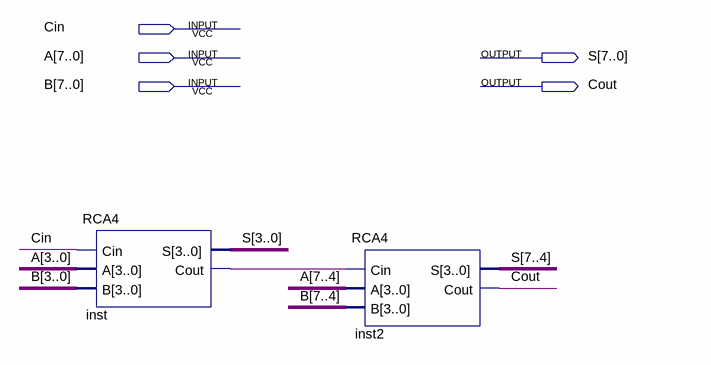
[diagram p0: schematic sheet]
// Quartus schematic RCA8.bdf as structural Verilog: 2 symbols, 5 pins
module RCA8 (
  input  Cin,
  input  [7:0] A,
  input  [7:0] B,
  output [7:0] S,
  output Cout
);

  wire inst_cout;

  RCA4 inst (.Cin(Cin), .A(A[3:0]), .B(B[3:0]), .S(S[3:0]), .Cout(inst_cout));
  RCA4 inst2 (.Cin(inst_cout), .A(A[7:4]), .B(B[7:4]), .S(S[7:4]), .Cout(Cout));
endmodule
